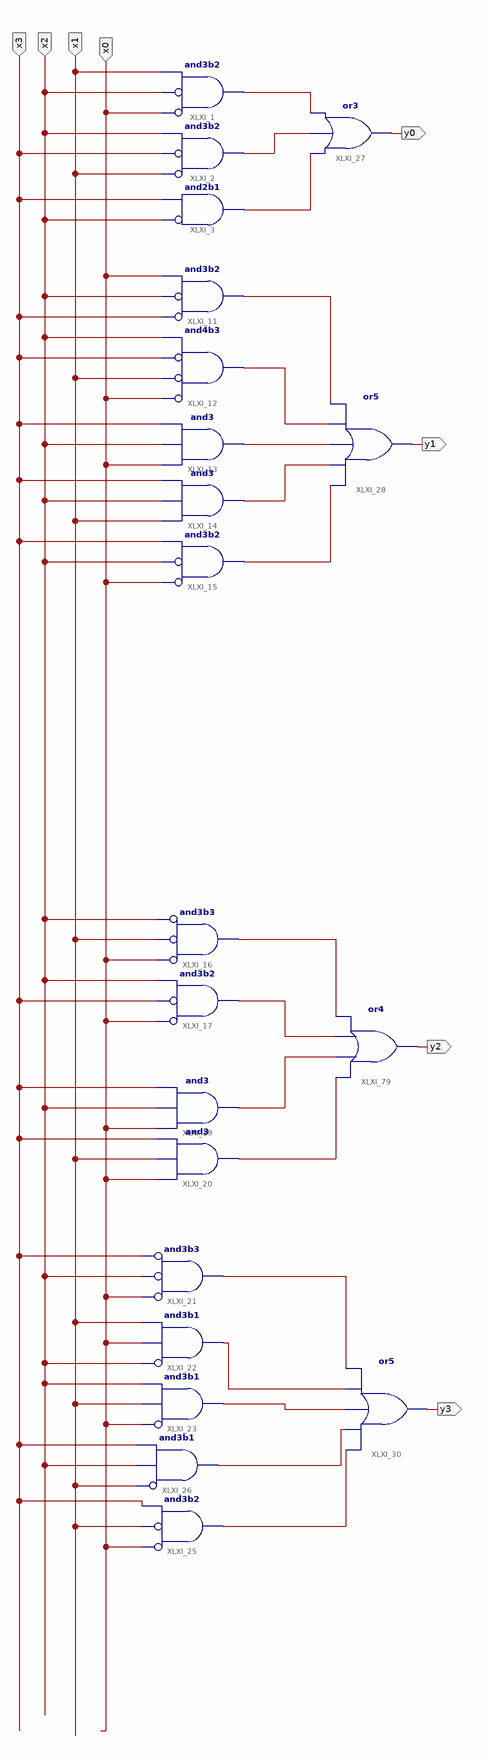
[diagram p0: schematic sheet 1]
// Xilinx ISE schematic DNF.sch (artix7) as structural Verilog: 21 symbols, 8 ports
module DNF (
  input  x3,
  input  x2,
  input  x1,
  input  x0,
  output y0,
  output y1,
  output y3,
  output y2
);

  wire XLXN_14, XLXN_15, XLXN_16, XLXN_18, XLXN_19, XLXN_20, XLXN_21, XLXN_22, XLXN_28, XLXN_29, XLXN_31,
       XLXN_32, XLXN_33, XLXN_34, XLXN_37, XLXN_38, XLXN_39;

  and XLXI_1 (XLXN_14, ~x0, ~x2, x1);  // and3b2
  and XLXI_2 (XLXN_15, ~x1, ~x3, x2);  // and3b2
  and XLXI_3 (XLXN_16, ~x2, x3);  // and2b1
  and XLXI_11 (XLXN_18, ~x3, ~x2, x0);  // and3b2
  and XLXI_12 (XLXN_19, ~x0, ~x1, ~x3, x2);  // and4b3
  and XLXI_13 (XLXN_20, x0, x2, x3);
  and XLXI_14 (XLXN_21, x1, x2, x3);
  and XLXI_15 (XLXN_22, ~x0, ~x2, x3);  // and3b2
  or XLXI_27 (y0, XLXN_16, XLXN_15, XLXN_14);
  or XLXI_28 (y1, XLXN_22, XLXN_21, XLXN_20, XLXN_19, XLXN_18);
  and XLXI_16 (XLXN_28, ~x0, ~x1, ~x2);  // and3b3
  and XLXI_17 (XLXN_29, ~x0, ~x3, x2);  // and3b2
  and XLXI_19 (XLXN_31, x0, x2, x3);
  and XLXI_20 (XLXN_32, x0, x1, x3);
  and XLXI_21 (XLXN_33, ~x0, ~x2, ~x3);  // and3b3
  and XLXI_22 (XLXN_34, ~x2, x0, x1);  // and3b1
  and XLXI_23 (XLXN_37, ~x0, x1, x2);  // and3b1
  and XLXI_25 (XLXN_39, ~x0, ~x1, x3);  // and3b2
  and XLXI_26 (XLXN_38, ~x1, x2, x3);  // and3b1
  or XLXI_30 (y3, XLXN_39, XLXN_38, XLXN_37, XLXN_34, XLXN_33);
  or XLXI_79 (y2, XLXN_32, XLXN_31, XLXN_29, XLXN_28);
endmodule
